# Altium schematic sheet interface.SchDoc
size A4
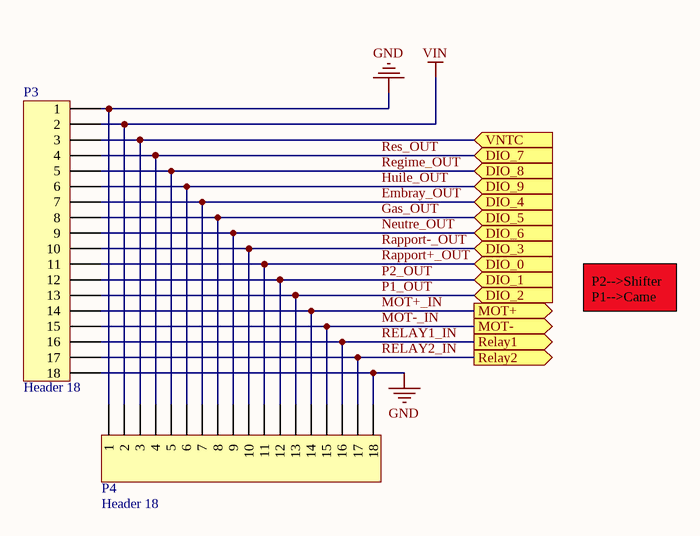
[diagram p0: interface.SchDoc]

## Parts
P3  Header 18  [PHOENIX_PTSA05_18]
P4  Header 18  [HDR1X18]

## Ports
DIO_0 (in), DIO_1 (in), DIO_2 (in), DIO_3 (in), DIO_4 (in), DIO_5 (in), DIO_6 (in), DIO_7 (in), DIO_8 (in), DIO_9 (in), MOT+ (out), MOT- (out), Relay1 (out), Relay2 (out), VNTC (in)

## Nets
GND: P3.1 P3.18 P4.1 P4.18
VIN: P3.2 P4.2
Embray_OUT: P3.7 P4.7 ; port DIO_4
Gas_OUT: P3.8 P4.8 ; port DIO_5
Huile_OUT: P3.6 P4.6 ; port DIO_9
MOT+_IN: P3.14 P4.14 ; port MOT+
MOT-_IN: P3.15 P4.15 ; port MOT-
Neutre_OUT: P3.9 P4.9 ; port DIO_6
P1_OUT: P3.13 P4.13 ; port DIO_2
P2_OUT: P3.12 P4.12 ; port DIO_1
Rapport+_OUT: P3.11 P4.11 ; port DIO_0
Rapport-_OUT: P3.10 P4.10 ; port DIO_3
Regime_OUT: P3.5 P4.5 ; port DIO_8
RELAY1_IN: P3.16 P4.16 ; port Relay1
RELAY2_IN: P3.17 P4.17 ; port Relay2
Res_OUT: P3.4 P4.4 ; port DIO_7
VNTC: P3.3 P4.3 ; port VNTC

## Notes on the sheet
- P2-->Shifter
  P1-->Came

## Library data of the parts
P3 = Header 18: Header, 10-Pin; manufacturer PartNum: 1990164; Manufacturer: Phoenix; LatestRevisionDate: 17-Jul-2002; LatestRevisionNote: Re-released for DXP Platform.; Publisher: Altium Limited; Digikey ref: 277-1810-ND
P4 = Header 18: Header, 10-Pin; LatestRevisionDate: 17-Jul-2002; LatestRevisionNote: Re-released for DXP Platform.; Publisher: Altium Limited